# EAGLE design Recevier (EAGLE 8.2.1)
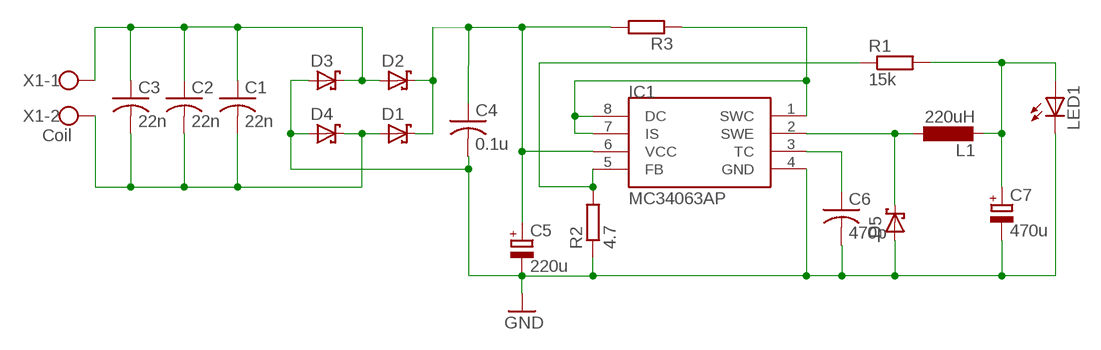
[diagram p0: schematic, sheet 1]

## Parts
C1  22n  C-US050-025X075  [C050-025X075]
C2  22n  C-US050-025X075  [C050-025X075]
C3  22n  C-US050-025X075  [C050-025X075]
C4  0.1u  C-US050-025X075  [C050-025X075]
C5  220u  CPOL-EUE5-10.5  [E5-10,5]
C6  470p  C-US050-025X075  [C050-025X075]
C7  470u  CPOL-EUE3.5-8  [E3,5-8]
D1  1N5819-B  [DO41-7.6]
D2  1N5819-B  [DO41-7.6]
D3  1N5819-B  [DO41-7.6]
D4  1N5819-B  [DO41-7.6]
D5  1N5819-B  [DO41-7.6]
IC1  MC34063AP  [DIL08]
L1  220uH  L-EU2200-12.7  [2200-12.7]
LED1  LED3MM  [LED3MM]
R1  15k  R-EU_0207/10  [0207/10]
R2  4.7  R-EU_0207/10  [0207/10]
R3  R-EU_0207/10  [0207/10]
X1  Coil  W237-102  [W237-102]

## Nets
GND: C4.2 C5.- C6.2 C7.- D3.A D4.A D5.A IC1.4(GND) LED1.K(C) R2.1
N$1: IC1.1(SWC) IC1.7(IS) IC1.8(DC) R3.1
N$2: C4.1 C5.+ D1.C D2.C IC1.6(VCC) R3.2
N$3: IC1.5(FB) R1.1 R2.2
N$4: C6.1 IC1.3(TC)
N$5: C1.1 C2.1 C3.1 D2.A D3.C X1.1
N$6: D5.C IC1.2(SWE) L1.1
N$7: C1.2 C2.2 C3.2 D1.A D4.C X1.2
N$8: C7.+ L1.2 LED1.A R1.2

## Library data of the parts
C1-C4 C6 = rcl:C-US: CAPACITOR, American symbol
C5 C7 = rcl:CPOL-EU: POLARIZED CAPACITOR, European symbol
D1-D5 = diode:1N581*: 1.0A SCHOTTKY BARRIER RECTIFIER Source: http://www.diodes.com/datasheets/ds23001.pdf
IC1 = vreg-pulse:MC34063: Motorola's 1.5 A, Step-Up/Down/Inverting Switching Regulator
L1 = resistor:L-EU: INDUCTOR, European symbol
LED1 = led:LED: LED OSRAM: - CHIPLED LG R971, LG N971, LY N971, LG Q971, LY Q971, LO R971, LY R971 LH N974, LH R974 LS Q976, LO Q976, LY Q976 LO Q996 - Hyper CHIPLED LW Q18S LB Q993, LB Q99A, LB R99A - SideLED LS A670, LO A670, LY A670, LG A670, LP A670 LB A673, LV A673, LT A673, LW A673 LH A674 LY A675 LS A676, LA A676, LO A676, LY A676, LW A676 LS A679, LY A679, LG A679 - Hyper Micro SIDELED® LS Y876, LA Y876, LO Y876, LY Y876 LT Y87S - SmartLED LW L88C, LW L88S LB L89C, LB L89S, LG L890 LS L89K, LO L89K, LY L89K LS L896, LA L896, LO L896, LY L896 - TOPLED LS T670, LO T670, LY T670, LG T670, LP T670 LSG T670, LSP T670, LSY T670, LOP T670, LYG T670 LG T671, LOG T671, LSG T671 LB T673, LV T673, LT T673, LW T673 LH T674 LS T676, LA T676, LO T676, LY T676, LB T676, LH T676, LSB T676, LW T676 LB T67C, LV T67C, LT T67C, LS T67K, LO T67K, LY T67K, LW E67C LS E67B, LA E67B, LO E67B, LY E67B, LB E67C, LV E67C, LT E67C LW T67C LS T679, LY T679, LG T679 LS T770, LO T770, LY T770, LG T770, LP T770 LB T773, LV T773, LT T773, LW T773 LH T774 LS E675, LA E675, LY E675, LS T675 LS T776, LA T776, LO T776, LY T776, LB T776 LHGB T686 LT T68C, LB T68C - Hyper Mini TOPLED® LB M676 - Mini TOPLED Santana® LG M470 LS M47K, LO M47K, LY M47K Source: http://www.osram.convergy.de LUXEON: - LUMILED® LXK2-PW12-R00, LXK2-PW12-S00, LXK2-PW14-U00, LXK2-PW14-V00 LXK2-PM12-R00, LXK2-PM12-S00, LXK2-PM14-U00 LXK2-PE12-Q00, LXK2-PE12-R00, LXK2-PE12-S00, LXK2-PE14-T00, LXK2-PE14-U00 LXK2-PB12-K00, LXK2-PB12-L00, LXK2-PB12-M00, LXK2-PB14-N00, LXK2-PB14-P00, LXK2-PB14-Q00 LXK2-PR12-L00, LXK2-PR12-M00, LXK2-PR14-Q00, LXK2-PR14-R00 LXK2-PD12-Q00, LXK2-PD12-R00, LXK2-PD12-S00 LXK2-PH12-R00, LXK2-PH12-S00 LXK2-PL12-P00, LXK2-PL12-Q00, LXK2-PL12-R00 Source: www.luxeon.com KINGBRIGHT: KA-3528ASYC Source: www.kingbright.com
R1-R3 = rcl:R-EU_: RESISTOR, European symbol
X1 = con-wago-500:W237-102: WAGO SCREW CLAMP; MPN: 237-102; OC_FARNELL: unknown; OC_NEWARK: 70K9898

## Board
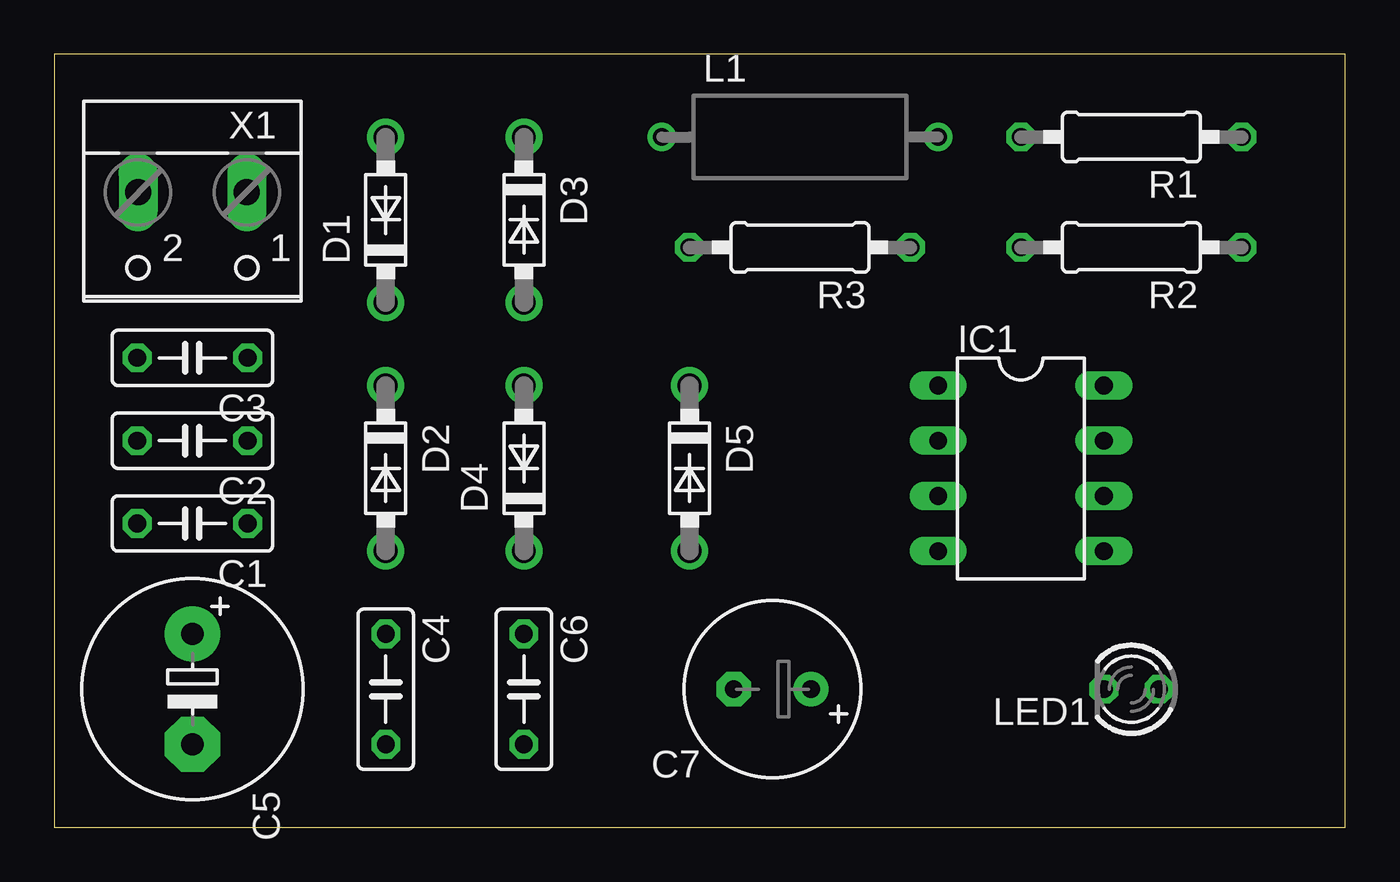
[diagram p1: board, top side]
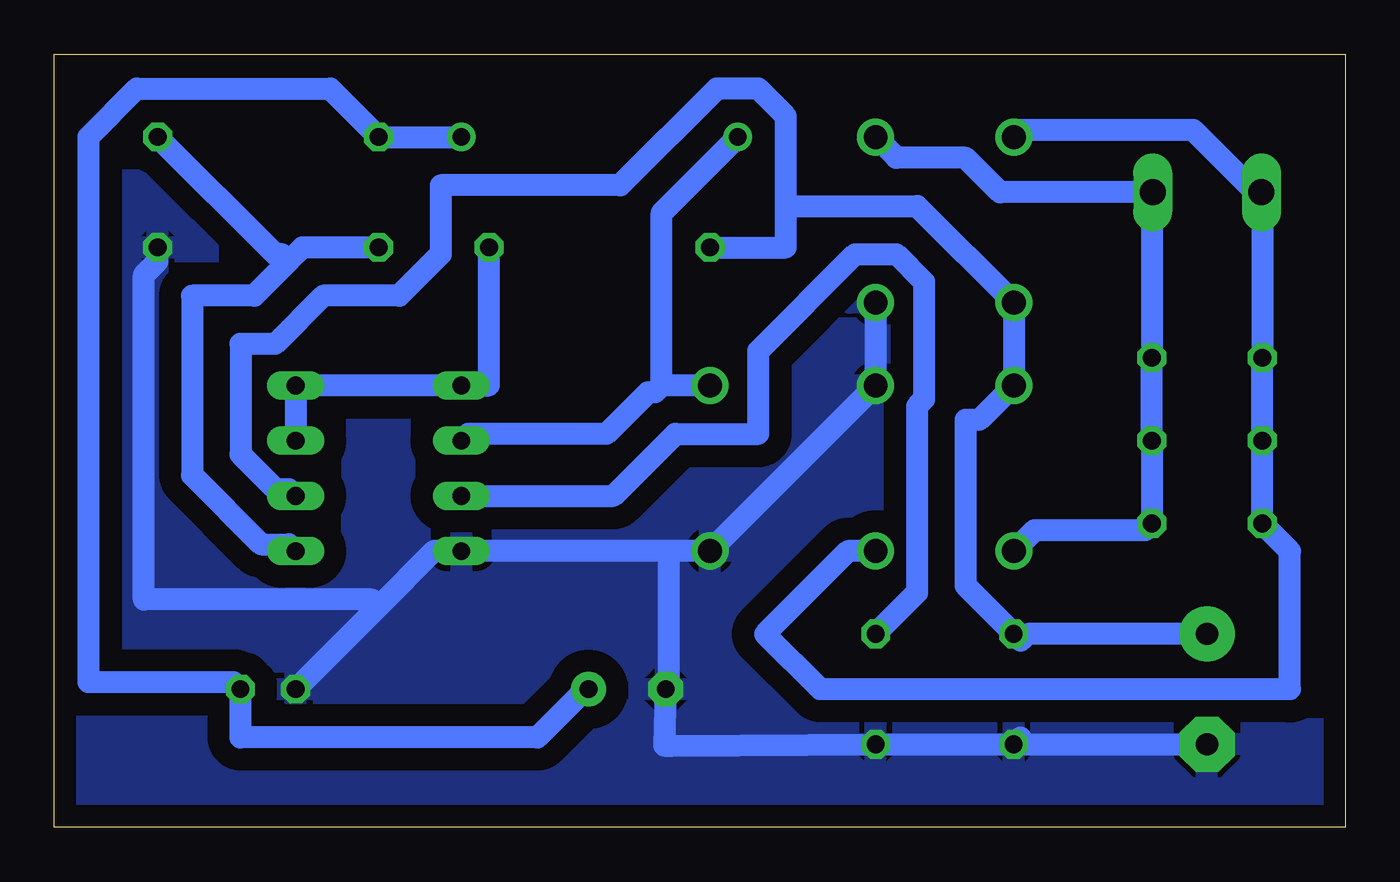
[diagram p2: board, bottom side, seen from below]

Size 59.36 x 35.55 mm. Coordinates in mm from the lower left corner, seen from the top.
Outline: 0,0 59.36,0 59.36,35.55 0,35.55 0,0
Copper layers (1*16): Top 0.035mm / dielectric 1.5mm / Bottom 0.035mm
Design rules "default *": minimum track width 40mil, minimum drill 0.35mm, track to track 40mil, track to pad 20mil, pad to pad 6mil, via to via 6mil, smd to smd 6mil, copper to edge 40mil, drill to drill 6mil, minimum pad ring 10mil, minimum via ring 8mil, stop-mask expansion 4mil, vias tented up to drill 0mil, thermal gap 10mil

### Footprints (pad centres in the part's own frame; a part is rotated, then mirrored left to right if it is on the bottom)
C050-025X075 = drill 0.813 octagon: 1 -2.54,0; 2 2.54,0
E5-10,5 = drill 1.016 pad 2.54: + -2.54,0 | drill 1.016 pad 2.54 octagon: - 2.54,0
E3,5-8 = drill 0.813 pad 1.6: + -1.778,0 | drill 0.813 pad 1.6 octagon: - 1.778,0
DO41-7.6 = drill 1.1 pad 1.7: A 3.81,0; C -3.81,0
DIL08 = drill 0.813 long: 1 -3.81,-3.81; 2 -1.27,-3.81; 3 1.27,-3.81; 4 3.81,-3.81; 5 3.81,3.81; 6 1.27,3.81; 7 -1.27,3.81; 8 -3.81,3.81
2200-12.7 = drill 0.8 pad 1.27: 1 -6.35,0; 2 6.35,0
LED3MM = drill 0.813 octagon: A -1.27,0; K 1.27,0
0207/10 = drill 0.813 octagon: 1 -5.08,0; 2 5.08,0
W237-102 = drill 1.194 long: 1 -2.5,-1.27; 2 2.5,-1.27

### Placement (x,y rotation side)
C1  6.35,13.97 180 top
C2  6.35,17.78 180 top
C3  6.35,21.59 180 top
C4  15.24,6.35 270 top
C5  6.35,6.35 270 top
C6  21.59,6.35 270 top
C7  33.02,6.35 180 top
D1  15.24,27.94 90 top
D2  15.24,16.51 270 top
D3  21.59,27.94 270 top
D4  21.59,16.51 90 top
D5  29.21,16.51 270 top
IC1  44.45,16.51 270 top
L1  34.29,31.75 0 top
LED1  49.53,6.35 180 top
R1  49.53,31.75 180 top
R2  49.53,26.67 180 top
R3  34.29,26.67 180 top
X1  6.35,27.94 180 top

### Tracks (layer width: path | path; a pad name or v marks a point on that pad's centre or on a via)
GND
  Bottom 1.016: 44.45,10.16 41.91,12.7 IC1.4 31.11,12.7 | 44.45,10.16 LED1.K | R2.1 54.61,26.04 55.24,25.4 55.24,10.48 44.77,10.48 44.45,10.16 | C4.2 C6.2 30.92,3.75 31.3,3.75 C7.- 31.11,6.35 31.11,12.7 | 14.92,4.13 C4.2 | D3.A D4.A D5.A 31.11,12.7 | C4.2 C5.-
  pour Bottom: 59.18,35.31 59.44,35.05 59.44,0 0.25,0 0.25,35.31 0.51,35.05
N$1
  Bottom 1.016: IC1.7 IC1.8 IC1.1 39.37,20.32 R3.1
N$2
  Bottom 1.016: IC1.6 48.58,15.56 49.21,15.56 50.8,17.14 50.8,22.23 49.21,22.23 46.99,24.45 43.5,24.45 41.59,26.35 41.59,29.53 33.34,29.53 28.89,33.97 26.99,33.97 25.72,32.7 25.72,28.57 | 25.72,28.57 25.72,26.67 R3.2 | 25.72,28.57 19.68,28.57 D1.C D2.C 16.83,18.73 17.46,18.73 17.46,11.11 C4.1 14.92,8.57 14.61,8.89 C5.+
N$3
  Bottom 1.016: IC1.5 48.58,13.02 49.85,13.02 53.02,16.19 53.02,24.45 50.16,24.45 48.58,26.04 | 48.58,26.04 47.94,26.67 R2.2 | R1.1 49.21,26.35 48.9,26.35 48.58,26.04
N$4
  Bottom 1.016: C6.1 19.68,10.79 19.68,19.37 19.37,19.68 19.37,25.08 20.64,26.35 22.54,26.35 26.99,21.91 26.99,18.1 30.8,18.1 33.66,15.24 IC1.3
N$5
  Bottom 1.016: D2.A 14.29,13.65 9.21,13.65 C1.1 C2.1 C3.1 8.89,28.89 X1.1 15.88,29.21 17.46,30.8 20.64,30.8 D3.C
N$6
  Bottom 1.016: L1.1 31.43,28.26 31.43,20.32 | D5.C 31.43,20.32 | IC1.2 40.32,18.1 33.97,18.1 32.07,20 31.75,20 31.43,20.32
N$7
  Bottom 1.016: D1.A 14.92,32.07 6.99,32.07 4.13,29.21 X1.2 3.81,28.89 C3.2 C2.2 C1.2 2.54,12.7 2.54,6.35 2.55,6.36 24.13,6.36 24.14,6.36 26.67,8.89 22.86,12.7 D4.C
N$8
  Bottom 1.016: L1.2 R1.2 46.67,33.97 55.56,33.97 57.78,31.75 57.78,6.67 51.12,6.67 LED1.A 50.8,4.13 37.15,4.13 34.92,6.35 C7.+